# EAGLE design 117_05_TIMER_GATE (EAGLE 9.6.2)
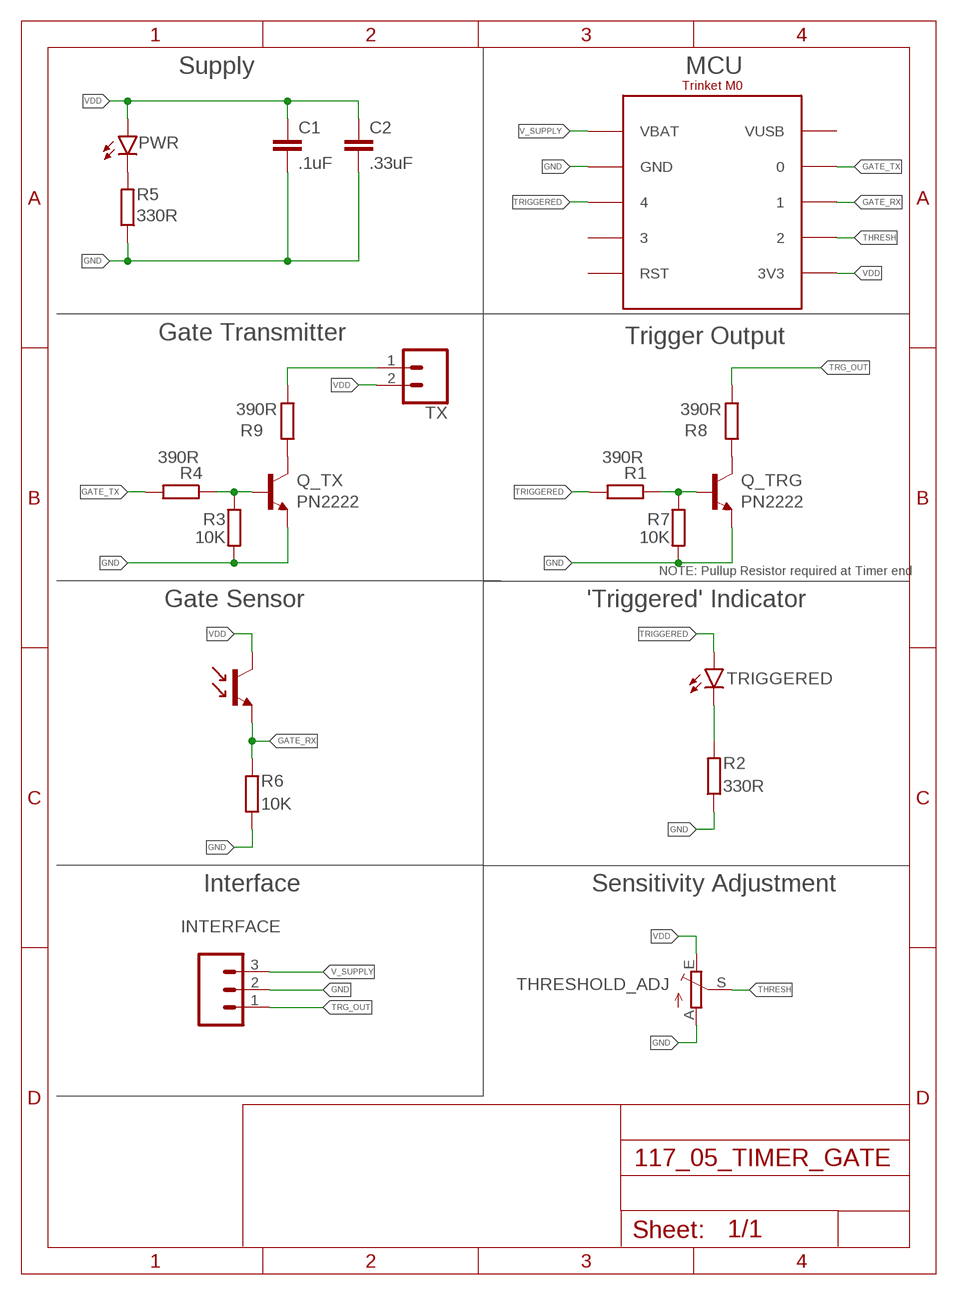
[diagram p0: schematic, sheet 1]

## Parts
C1  .1uF  C-EUC0805K  [C0805K]
C2  .33uF  C-EUC0805K  [C0805K]
INTERFACE  CONN_03LONGPADS  [1X03_LONGPADS]
PWR  LEDSML0805  [SML0805]
Q_TRG  PN2222  2N2222-NPN-TO92-EBC  [TO92-EBC]
Q_TX  PN2222  2N2222-NPN-TO92-EBC  [TO92-EBC]
R1  390R  R-EU_M0805  [M0805]
R2  330R  R-EU_M0805  [M0805]
R3  10K  R-EU_M0805  [M0805]
R4  390R  R-EU_M0805  [M0805]
R5  330R  R-EU_M0805  [M0805]
R6  10K  R-EU_M0805  [M0805]
R7  10K  R-EU_M0805  [M0805]
R8  390R  R-EU_M0805  [M0805]
R9  390R  R-EU_M0805  [M0805]
THRESHOLD_ADJ  TRIM_EU-S64W  [S64W]
TRIGGERED  LED5MM  [LED_5MM]
TX  CONN_02PTH3  [1X02_LONGPADS]
U$1  TRINKETM0  [TRINKETM0]
U$2  PHOTOTRANSISTOR  [LED_5MM]

## Nets
GATE_RX: R6.2 U$1.1 U$2.K(E)
GATE_TX: R4.2 U$1.0
GND: C1.2 C2.2 INTERFACE.2 Q_TRG.E Q_TX.E R2.1 R3.2 R5.1 R6.1 R7.2 THRESHOLD_ADJ.A U$1.GND
N$1: PWR.C R5.2
N$2: R9.1 TX.1
N$3: Q_TRG.B R1.1 R7.1
N$4: Q_TX.B R3.1 R4.1
N$5: Q_TX.C R9.2
N$6: Q_TRG.C R8.2
N$10: R2.2 TRIGGERED.K(C)
THRESH: THRESHOLD_ADJ.S U$1.2
TRG_OUT: INTERFACE.1 R8.1
TRIGGERED: R1.2 TRIGGERED.A U$1.4
V_SUPPLY: INTERFACE.3 U$1.VBAT
VDD: C1.1 C2.1 PWR.A THRESHOLD_ADJ.E TX.2 U$1.3V3 U$2.A(C)
Unconnected: U$1.3 U$1.RST U$1.VUSB

## Notes on the sheet
- Supply | MCU
- Gate Transmitter | Trigger Output
- NOTE: Pullup Resistor required at Timer end
- Gate Sensor | 'Triggered' Indicator
- Interface | Sensitivity Adjustment

## Library data of the parts
C1 C2 = rcl:C-EU: CAPACITOR, European symbol; SPICEPREFIX: C
INTERFACE = SparkFun-Connectors:CONN_03: Multi connection point. Often used as Generic Header-pin footprint for 0.1 inch spaced/style header connections On any of the 0.1 inch spaced packages, you can populate with these: Break Away Headers - Straight <https://www.sparkfun.com/products/116> (PRT-00116) Break Away Male Headers - Right Angle <https://www.sparkfun.com/products/553> (PRT-00553) Female Headers <https://www.sparkfun.com/products/115> (PRT-00115) Break Away Headers - Machine Pin <https://www.sparkfun.com/products/117> (PRT-00117) Break Away Female Headers - Swiss Machine Pin <https://www.sparkfun.com/products/743> (PRT-00743) Stackable Header - 3 Pin (Female, 0.1") <https://www.sparkfun.com/products/13875> (PRT-13875) For SCREWTERMINALS and SPRING TERMINALS visit here: Screw Terimnals on SparkFun.com <https://www.sparkfun.com/search/results?term=Screw+Terminals> (5mm/3.5mm/2.54mm spacing) This device is also useful as a general connection point to wire up your design to another part of your project. Our various solder wires solder well into these plated through hole pads. Hook-Up Wire - Assortment (Stranded, 22 AWG) <https://www.sparkfun.com/products/11375> (PRT-11375) Hook-Up Wire - Assortment (Solid Core, 22 AWG) <https://www.sparkfun.com/products/11367> (PRT-11367) View the entire wire category on our website here <https://www.sparkfun.com/categories/141> Special notes: Molex polarized connector foot print use with SKU : PRT-08232 with associated crimp pins and housings.
PWR = led:LED: LED OSRAM: - CHIPLED LG R971, LG N971, LY N971, LG Q971, LY Q971, LO R971, LY R971 LH N974, LH R974 LS Q976, LO Q976, LY Q976 LO Q996 - Hyper CHIPLED LW Q18S LB Q993, LB Q99A, LB R99A - SideLED LS A670, LO A670, LY A670, LG A670, LP A670 LB A673, LV A673, LT A673, LW A673 LH A674 LY A675 LS A676, LA A676, LO A676, LY A676, LW A676 LS A679, LY A679, LG A679 - Hyper Micro SIDELED® LS Y876, LA Y876, LO Y876, LY Y876 LT Y87S - SmartLED LW L88C, LW L88S LB L89C, LB L89S, LG L890 LS L89K, LO L89K, LY L89K LS L896, LA L896, LO L896, LY L896 - TOPLED LS T670, LO T670, LY T670, LG T670, LP T670 LSG T670, LSP T670, LSY T670, LOP T670, LYG T670 LG T671, LOG T671, LSG T671 LB T673, LV T673, LT T673, LW T673 LH T674 LS T676, LA T676, LO T676, LY T676, LB T676, LH T676, LSB T676, LW T676 LB T67C, LV T67C, LT T67C, LS T67K, LO T67K, LY T67K, LW E67C LS E67B, LA E67B, LO E67B, LY E67B, LB E67C, LV E67C, LT E67C LW T67C LS T679, LY T679, LG T679 LS T770, LO T770, LY T770, LG T770, LP T770 LB T773, LV T773, LT T773, LW T773 LH T774 LS E675, LA E675, LY E675, LS T675 LS T776, LA T776, LO T776, LY T776, LB T776 LHGB T686 LT T68C, LB T68C - Hyper Mini TOPLED® LB M676 - Mini TOPLED Santana® LG M470 LS M47K, LO M47K, LY M47K Source: http://www.osram.convergy.de LUXEON: - LUMILED® LXK2-PW12-R00, LXK2-PW12-S00, LXK2-PW14-U00, LXK2-PW14-V00 LXK2-PM12-R00, LXK2-PM12-S00, LXK2-PM14-U00 LXK2-PE12-Q00, LXK2-PE12-R00, LXK2-PE12-S00, LXK2-PE14-T00, LXK2-PE14-U00 LXK2-PB12-K00, LXK2-PB12-L00, LXK2-PB12-M00, LXK2-PB14-N00, LXK2-PB14-P00, LXK2-PB14-Q00 LXK2-PR12-L00, LXK2-PR12-M00, LXK2-PR14-Q00, LXK2-PR14-R00 LXK2-PD12-Q00, LXK2-PD12-R00, LXK2-PD12-S00 LXK2-PH12-R00, LXK2-PH12-S00 LXK2-PL12-P00, LXK2-PL12-Q00, LXK2-PL12-R00 Source: www.luxeon.com KINGBRIGHT: KA-3528ASYC Source: www.kingbright.com
Q_TRG Q_TX = transistor-neu-to92:*-NPN-: NPN Transistror
R1-R9 = rcl:R-EU_: RESISTOR, European symbol; SPICEPREFIX: R
THRESHOLD_ADJ = pot:TRIM_EU-: POTENTIOMETER
TRIGGERED = SparkFun-LED:LED: LED (Generic) Standard schematic elements and footprints for 5mm, 3mm, 1206, and 0603 sized LEDs. Generic LEDs with no color specified.
TX = SparkFun-Connectors:CONN_02: Multi connection point. Often used as Generic Header-pin footprint for 0.1 inch spaced/style header connections On any of the 0.1 inch spaced packages, you can populate with these: Break Away Headers - Straight <https://www.sparkfun.com/products/116> (PRT-00116) Break Away Male Headers - Right Angle <https://www.sparkfun.com/products/553> (PRT-00553) Female Headers <https://www.sparkfun.com/products/115> (PRT-00115) Break Away Headers - Machine Pin <https://www.sparkfun.com/products/117> (PRT-00117) Break Away Female Headers - Swiss Machine Pin <https://www.sparkfun.com/products/743> (PRT-00743) For SCREWTERMINALS and SPRING TERMINALS visit here: Screw Terimnals on SparkFun.com <https://www.sparkfun.com/search/results?term=Screw+Terminals> (5mm/3.5mm/2.54mm spacing) This device is also useful as a general connection point to wire up your design to another part of your project. Our various solder wires solder well into these plated through hole pads. Hook-Up Wire - Assortment (Stranded, 22 AWG) <https://www.sparkfun.com/products/11375> (PRT-11375) Hook-Up Wire - Assortment (Solid Core, 22 AWG) <https://www.sparkfun.com/products/11367> (PRT-11367) View the entire wire category on our website here <https://www.sparkfun.com/categories/141> Special notes: Molex polarized connector foot print use with: PRT-08233 with associated crimp pins and housings. 2.54_SCREWTERM for use with PRT-10571. 3.5mm Screw Terminal footprints for PRT-08084 5mm Screw Terminal footprints for use with PRT-08432
U$1 = Stephen:TRINKETM0
U$2 = Stephen:PHOTOTRANSISTOR

## Board
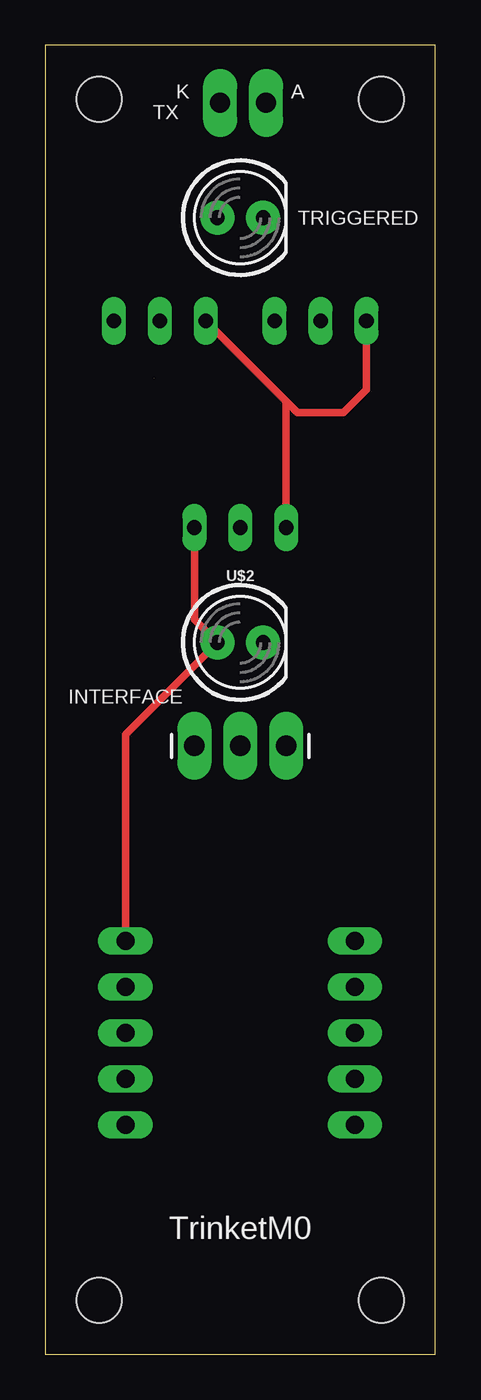
[diagram p1: board, top side]
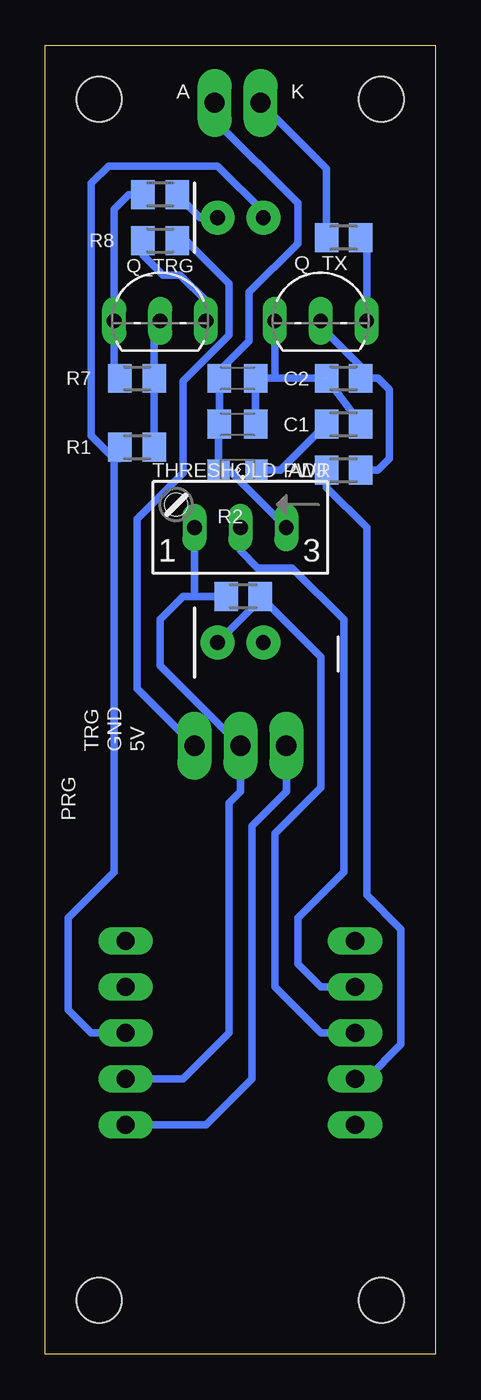
[diagram p2: board, bottom side, seen from below]

Size 21.6 x 72.4 mm. Coordinates in mm from the lower left corner, seen from the top.
Outline: 0,0 21.6,0 21.6,72.4 0,72.4 0,0
Copper layers (1*16): Top 0.035mm / dielectric 1.5mm / Bottom 0.035mm
Design rules "default *": minimum track width 6mil, minimum drill 0.35mm, track to track 6mil, track to pad 6mil, pad to pad 6mil, via to via 6mil, smd to smd 6mil, copper to edge 40mil, drill to drill 6mil, minimum pad ring 10mil, minimum via ring 8mil, stop-mask expansion 4mil, vias tented up to drill 50mil, thermal gap 10mil
Holes 2.5 mm at 18.6,3 18.6,69.4 3,69.4 3,3

### Footprints (pad centres in the part's own frame; a part is rotated, then mirrored left to right if it is on the bottom)
C0805K = smd 1.3 x 1.6: 1 -1,0; 2 1,0
1X03_LONGPADS = drill 1.118 pad 1.88 long: 1 0,0; 2 2.54,0; 3 5.08,0
SML0805 = smd 1.2 x 1.2: A 1.05,0; C -1.05,0
TO92-EBC = drill 0.813 long: B 0,-1.27; C 2.54,-1.27; E -2.54,-1.27
M0805 = smd 1.3 x 1.6: 1 -0.95,0; 2 0.95,0
S64W = drill 0.813 long: A 2.54,1.27; E -2.54,1.27; S 0,1.27
LED_5MM = drill 0.813 pad 1.88: A -1.27,0; K 1.27,0
1X02_LONGPADS = drill 1.118 pad 1.88 long: 1 0,0; 2 2.54,0
TRINKETM0 = drill 1 long: 0 6.35,2.54; 1 6.35,0; 2 6.35,-2.54; 3 -6.35,-2.54; 3V3 6.35,-5.08; 4 -6.35,0; GND -6.35,2.54; RST -6.35,-5.08; VBAT -6.35,5.08; VUSB 6.35,5.08

### Placement (x,y rotation side)
C1  10.95,51.44 0 bottom
C2  10.95,53.98 0 bottom
INTERFACE  13.33,33.66 180 top
PWR  10.95,48.9 180 bottom
Q_TRG  15.24,58.42 0 bottom
Q_TX  6.35,58.42 0 bottom
R1  16.51,50.16 180 bottom
R2  15.24,64.14 0 bottom
R3  5.08,53.98 180 bottom
R4  5.08,48.9 180 bottom
R5  5.08,51.44 180 bottom
R6  10.64,41.91 0 bottom
R7  16.51,53.98 180 bottom
R8  15.24,61.59 180 bottom
R9  5.08,61.75 0 bottom
THRESHOLD_ADJ  10.79,46.99 180 bottom
TRIGGERED  10.79,62.87 0 top
TX  9.68,69.22 0 top
U$1  10.79,17.78 180 top
U$2  10.79,39.37 0 top

### Tracks (layer width: path | path; a pad name or v marks a point on that pad's centre or on a via)
GATE_RX
  Bottom 0.406: U$2.K 9.69,41.75 R6.2 8.65,40.88 6.35,38.57 6.35,35.56 6.35,31.35 8.89,28.81 8.89,20.32 6.35,17.78 U$1.1
GATE_TX
  Bottom 0.406: R4.2 6.03,47.94 3.81,45.72 3.81,30.48 | 3.81,30.48 3.81,30 | 3.81,30.48 3.81,25.4 1.91,23.5 1.91,17.14 3.81,15.24 U$1.0
GND  (1 unrouted)
  Top 0.406: Q_TRG.E 17.78,53.34 16.51,52.07 13.97,52.07 13.33,52.7 | 13.33,52.7 Q_TX.E | THRESHOLD_ADJ.A 13.33,52.7
  Bottom 0.406: 5.87,53.82 R3.2 R5.1 | R7.2 17.78,54.3 Q_TRG.E 17.78,63.34 16.98,64.14 R2.1 | C1.2 C2.2 8.89,53.98 | R3.2 7.78,53.98 8.89,53.98 | THRESHOLD_ADJ.A 13.33,41.91 | 13.33,41.91 13.97,41.91 15.24,40.64 15.24,38.1 INTERFACE.2 10.79,33.02 | 13.33,41.91 R6.1 | Q_TX.E 8.89,53.98 | 10.79,32.69 10.79,33.02 | U$1.GND 13.97,15.24 11.43,17.78 11.43,30.48 10.79,31.11 10.79,33.02
N$1
  Bottom 0.406: PWR.C 8.57,48.9 R5.2
N$2
  Bottom 0.406: TX.1 6.03,65.56 R9.1
N$3
  Bottom 0.406: Q_TRG.B 15.56,56.83 R7.1 R1.1
N$4
  Bottom 0.406: Q_TX.B 6.35,56.83 4.13,54.61 R3.1 3.17,53.98 2.54,53.34 2.54,49.53 3.17,48.9 R4.1
N$5
  Bottom 0.406: R9.2 3.81,61.43 Q_TX.C
N$6
  Bottom 0.406: Q_TRG.C 12.7,58.26 14.13,59.69 15.08,59.69 16.19,60.8 R8.2
N$10
  Bottom 0.406: R2.2 13.02,62.87 TRIGGERED.K
THRESH
  Bottom 0.406: THRESHOLD_ADJ.S 10.79,44.45 9.84,43.5 7.94,43.5 5.08,40.64 5.08,26.67 7.62,24.13 7.62,21.59 6.35,20.32 U$1.2
TRG_OUT
  Bottom 0.406: R8.1 13.81,61.59 11.43,59.21 11.43,56.36 13.97,53.82 13.97,48.74 16.51,46.2 16.51,36.83 INTERFACE.1
TRIGGERED
  Bottom 0.406: R1.2 17.46,49.53 17.78,49.53 | 17.78,49.53 17.78,48.74 17.78,34.29 | TRIGGERED.A 9.53,63.18 12.06,65.72 18.1,65.72 19.05,64.77 19.05,50.8 17.78,49.53 | 17.78,32.86 17.78,34.29 | 17.78,34.29 17.78,26.67 20.32,24.13 20.32,19.05 19.05,17.78 U$1.4
V_SUPPLY
  Bottom 0.406: INTERFACE.3 8.26,31.11 10.16,29.21 10.16,15.24 12.7,12.7 U$1.VBAT
VDD
  Top 0.406: THRESHOLD_ADJ.E 8.26,40.64 U$2.A 4.45,34.29 U$1.3V3
  Bottom 0.406: THRESHOLD_ADJ.E 11.43,48.9 PWR.A 12,51.38 C1.1 C2.1 11.95,54.4 10.32,56.04 10.32,58.74 7.62,61.44 7.62,63.66 12.22,68.26 TX.2

### Text on the board
bPlace: 5V | GND | TRG | PRG
tNames: K | A
bNames: K | A | R2